# EAGLE design RMR-AVR-ISP-Shield (EAGLE 9.6.0)
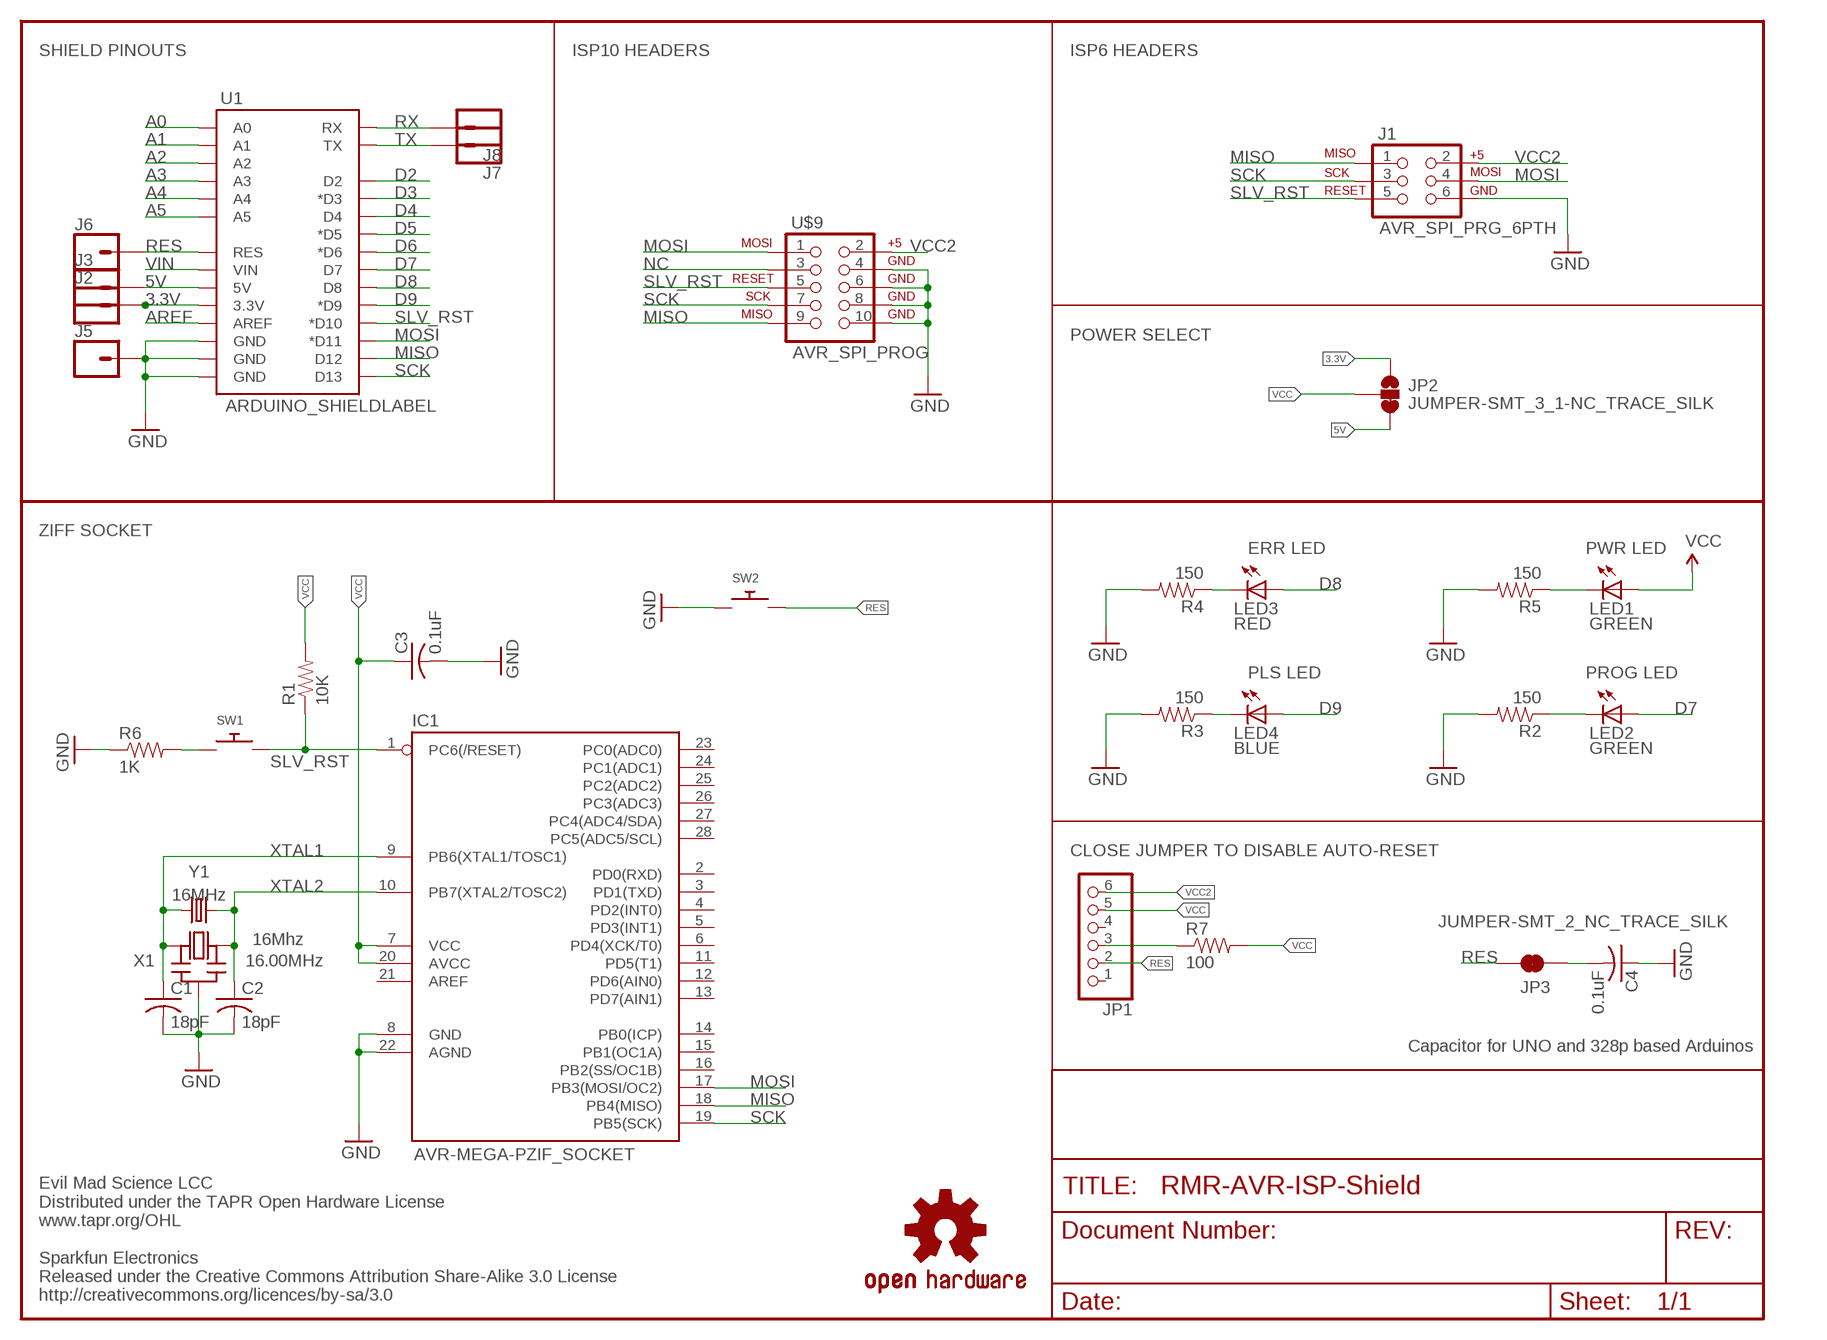
[diagram p0: schematic, sheet 1]

## Parts
C1  18pF  C-US025-024X044  [C025-024X044]
C2  18pF  C-US025-024X044  [C025-024X044]
C3  0.1uF  C-US025-024X044  [C025-024X044]
C4  0.1uF  C-US025-024X044  [C025-024X044]
IC1  AVR-MEGA-PZIF_SOCKET  AVR-MEGA8-PZIF_SOCKET  [DIL28-3-ZIF_SOCKET]
J1  AVR_SPI_PRG_6PTH  [2X3]
J2  CONN_01  [1X01]
J3  CONN_01  [1X01]
J5  CONN_01  [1X01]
J6  CONN_01  [1X01]
J7  CONN_01  [1X01]
J8  CONN_01  [1X01]
JP1  PINHD-1X6/90  [1X06/90]
JP2  JUMPER-SMT_3_1-NC_TRACE_SILK  [SMT-JUMPER_3_1-NC_TRACE_SILK]
JP3  JUMPER-SMT_2_NC_TRACE_SILK  [SMT-JUMPER_2_NC_TRACE_SILK]
LED1  GREEN  LED3MM  [LED3MM]
LED2  GREEN  LED3MM  [LED3MM]
LED3  RED  LED3MM  [LED3MM]
LED4  BLUE  LED3MM  [LED3MM]
R1  10K  RESISTORPTH-1/4W  [AXIAL-0.4]
R2  150  RESISTORPTH-1/4W  [AXIAL-0.4]
R3  150  RESISTORPTH-1/4W  [AXIAL-0.4]
R4  150  RESISTORPTH-1/4W  [AXIAL-0.4]
R5  150  RESISTORPTH-1/4W  [AXIAL-0.4]
R6  1K  RESISTORPTH-1/4W  [AXIAL-0.4]
R7  100  RESISTORPTH-1/4W  [AXIAL-0.4]
SW1  SWITCH_PUSHBUTTONEVQ-PE  [TACT_PANA-EVQ]
SW2  SWITCH_PUSHBUTTONEVQ-PE  [TACT_PANA-EVQ]
U1  ARDUINO_SHIELDLABEL  [DUEMILANOVE_SHIELD]
U$4  OSHW-LOGOM  [OSHW-LOGO-M]
U$9  AVR_SPI_PROG  [AVR_ICSP]
X1  16.00MHz  CERMOSCILL  [CERM_OSC]
Y1  16MHz  CRYSTAL-16MHZPTH-HC49US  [HC49US]

## Nets
3.3V: J2.1 JP2.1 U1.3.3V
5V: J3.1 JP2.3 U1.5V
A0: U1.A0
A1: U1.A1
A2: U1.A2
A3: U1.A3
A4: U1.A4
A5: U1.A5
AREF: U1.AREF
D2: U1.D2
D3: U1.D3(*D3)
D4: U1.D4
D5: U1.D5(*D5)
D6: U1.D6(*D6)
D7: LED2.A U1.D7
D8: LED3.A U1.D8
D9: LED4.A U1.D9(*D9)
GND: C1.2 C2.2 C3.2 C4.1 IC1.8(GND) IC1.22(AGND) J1.6 J5.1 R2.P$2 R3.P$2 R4.P$2 R5.P$2 R6.P$1 SW2.P$1 U1.GND@0(GND) U1.GND@1(GND) U1.GND@2(GND) U$9.4 U$9.6 U$9.8 U$9.10 X1.P$2(GND)
MISO: IC1.18(PB4(MISO)) J1.1 U1.D12 U$9.9
MOSI: IC1.17(PB3(MOSI/OC2)) J1.4 U1.D11(*D11) U$9.1
N$1: R6.P$2 SW1.P$1
N$2: LED2.K(C) R2.P$1
N$3: LED3.K(C) R4.P$1
N$4: LED1.K(C) R5.P$1
N$5: JP1.3 R7.P$1
N$6: LED4.K(C) R3.P$1
N$7: C4.2 JP3.1
NC: U$9.3
RES: J6.1 JP1.2 JP3.2 SW2.P$2 U1.RES
RX: J8.1 U1.RX
SCK: IC1.19(PB5(SCK)) J1.3 U1.D13 U$9.7
SLV_RST: IC1.1(PC6(/RESET)) J1.5 R1.P$1 SW1.P$2 U1.D10(*D10) U$9.5
TX: J7.1 U1.TX
VCC: C3.1 IC1.7(VCC) IC1.20(AVCC) JP1.5 JP2.2 LED1.A R1.P$2 R7.P$2
VCC2: J1.2 JP1.6 U$9.2
VIN: U1.VIN
XTAL1: C1.1 IC1.9(PB6(XTAL1/TOSC1)) X1.P$1(IN) Y1.1
XTAL2: C2.1 IC1.10(PB7(XTAL2/TOSC2)) X1.P$3(OUT) Y1.2
Unconnected: IC1.2(PD0(RXD)) IC1.3(PD1(TXD)) IC1.4(PD2(INT0)) IC1.5(PD3(INT1)) IC1.6(PD4(XCK/T0)) IC1.11(PD5(T1)) IC1.12(PD6(AIN0)) IC1.13(PD7(AIN1)) IC1.14(PB0(ICP)) IC1.15(PB1(OC1A)) IC1.16(PB2(SS/OC1B)) IC1.21(AREF) IC1.23(PC0(ADC0)) IC1.24(PC1(ADC1)) IC1.25(PC2(ADC2)) IC1.26(PC3(ADC3)) IC1.27(PC4(ADC4/SDA)) IC1.28(PC5(ADC5/SCL)) JP1.1 JP1.4

## Notes on the sheet
- SHIELD PINOUTS | ISP10 HEADERS | ISP6 HEADERS
- POWER SELECT
- ZIFF SOCKET
- ERR LED | PWR LED
- PLS LED | PROG LED
- CLOSE JUMPER TO DISABLE AUTO-RESET
- 16Mhz
- Capacitor for UNO and 328p based Arduinos
- Evil Mad Science LCC
  Distributed under the TAPR Open Hardware License
  www.tapr.org/OHL
  
  Sparkfun Electronics
  Released under the Creative Commons Attribution Share-Alike 3.0 License
  http://creativecommons.org/licences/by-sa/3.0

## Library data of the parts
C1-C4 = adafruit:C-US: CAPACITOR, American symbol
IC1 = SparkFun:AVR-MEGA8-P: MICROCONTROLLER 8 Kbytes FLASH 1 kbytes SRAM 512 bytes EEPROM USART 4-channel 10 bit ADC 2-channel 8 bit ADC
J1 = SparkFun:AVR_SPI_PRG_6: AVR ISP 6 Pin This is the reduced ISP connector for AVR programming. Common on Arduino. This footprint will take up less PCB space and can be used with a 10-pin to 6-pin adapter such as SKU: BOB-08508
J2 J3 J5-J8 = SparkFun-Connectors:CONN_01: Single connection point. Often used as Generic Header-pin footprint for 0.1 inch spaced/style header connections On any of the 0.1 inch spaced packages, you can populate with these: Break Away Headers - Straight <https://www.sparkfun.com/products/116> (PRT-00116) Break Away Male Headers - Right Angle <https://www.sparkfun.com/products/553> (PRT-00553) Female Headers <https://www.sparkfun.com/products/115> (PRT-00115) Break Away Headers - Machine Pin <https://www.sparkfun.com/products/117> (PRT-00117) Break Away Female Headers - Swiss Machine Pin <https://www.sparkfun.com/products/743> (PRT-00743) This device is also useful as a general connection point to wire up your design to another part of your project. Our various solder wires solder well into these plated through hole pads. Hook-Up Wire - Assortment (Stranded, 22 AWG) <https://www.sparkfun.com/products/11375> (PRT-11375) Hook-Up Wire - Assortment (Solid Core, 22 AWG) <https://www.sparkfun.com/products/11367> (PRT-11367) View the entire wire category on our website here <https://www.sparkfun.com/categories/141> Special notes: SMTSO-256-ET is a "flush mount" nut for a 4-40 screw. We mostly use this on specialty testbeds; it is a nice way to connect hardware to your PCB at an adjustable hieght. Also note, the SNAP packages are for using a snappable style connector. We sell a baggie of snaps and they are also used on two LilyPad designs: Snap Assortment - 30 pack (male and female) <https://www.sparkfun.com/products/11347> (DEV-11347) LilyPad Arduino SimpleSnap <https://www.sparkfun.com/products/10941> (DEV-10941) LilyPad SimpleSnap Protoboard <https://www.sparkfun.com/products/10940> (DEV-10940)
JP1 = pinhead:PINHD-1X6: PIN HEADER
JP2 = SparkFun-Jumpers:JUMPER-SMT_3_1-NC_TRACE: Normally closed trace jumper (1 of 2 connections) This jumper has a trace between two pads so it's normally closed (NC). The other connection is normally open (NO). Use a razor knife to open the connection. For best results follow the IPC guidelines for cutting traces: Cutout at least 0.063 mm (0.005 in). Remove all loose material to clean up the cut area. Seal the cut with an approved epoxy. Reapply solder to reclose the connection, or to close the NO connection.
JP3 = SparkFun-Jumpers:JUMPER-SMT_2_NC_TRACE: Normally closed trace jumper This jumper has a trace between two pads so it's normally closed (NC). Use a razor knife to open the connection. For best results follow the IPC guidelines for cutting traces: Cutout at least 0.063 mm (0.005 in). Remove all loose material to clean up the cut area. Seal the cut with an approved epoxy. Reapply solder to reclose the connection.
LED1-LED4 = SparkFun:LED: LEDs Standard schematic elements and footprints for 5mm, 3mm, 1206, and 0603 sized LEDs. 5mm - Spark Fun Electronics SKU : COM-00529 (and others)
R1-R7 = SparkFun:RESISTOR: Resistor Basic schematic elements and footprints for 0603, 1206, and PTH resistors.
SW1 SW2 = adafruit:SWITCH_PUSHBUTTON: Buttons SOFTTOUCHSMD_SJ - Soft touch temporary push button (Super Junk Akihabara) Compatible with SKPMANE010 [Mouser: 688-SKPMAN] C&K_KSS = Digikey: KSS221GLFS
U1 = SparkFun:ARDUINO_SHIELD
U$4 = SparkFun:OSHW-LOGO: Open Source Hardware Logo This logo indicates the piece of hardware it is found on incorporates a OSHW license and/or adheres to the definition of open source hardware found here: http://freedomdefined.org/OSHW
U$9 = SparkFun:AVR_SPI_PROG: AVR ICSP Header This is the standard AVR In Circuit Serial Programming header. Minimal, but includes pin one indicator. Works with standard Olimex programmers. Also look for the 6-pin reduced version. Spark Fun Electronics SKU: PRT-00778
X1 = digg:CERMOSCILL
Y1 = SparkFun-Clocks:CRYSTAL-16MHZ: 16MHz Crystal Digikey Example <http://www.digikey.com/product-search/en?keywords=535-9122-1-ND> Frequency: 16MHz Frequency Stability: ±50ppm Frequency Tolerance: ±20ppm Load Capacitance: 18pF SparkFun Products: Pro Micro -5V/16MHz <https://www.sparkfun.com/products/12640> SparkFun Serial Enabled LCD Kit <https://www.sparkfun.com/products/10097>; PROD_ID: XTAL-08181; SF_ID: COM-00536

## Net classes
1 vcc: width 0.254 mm

## Board
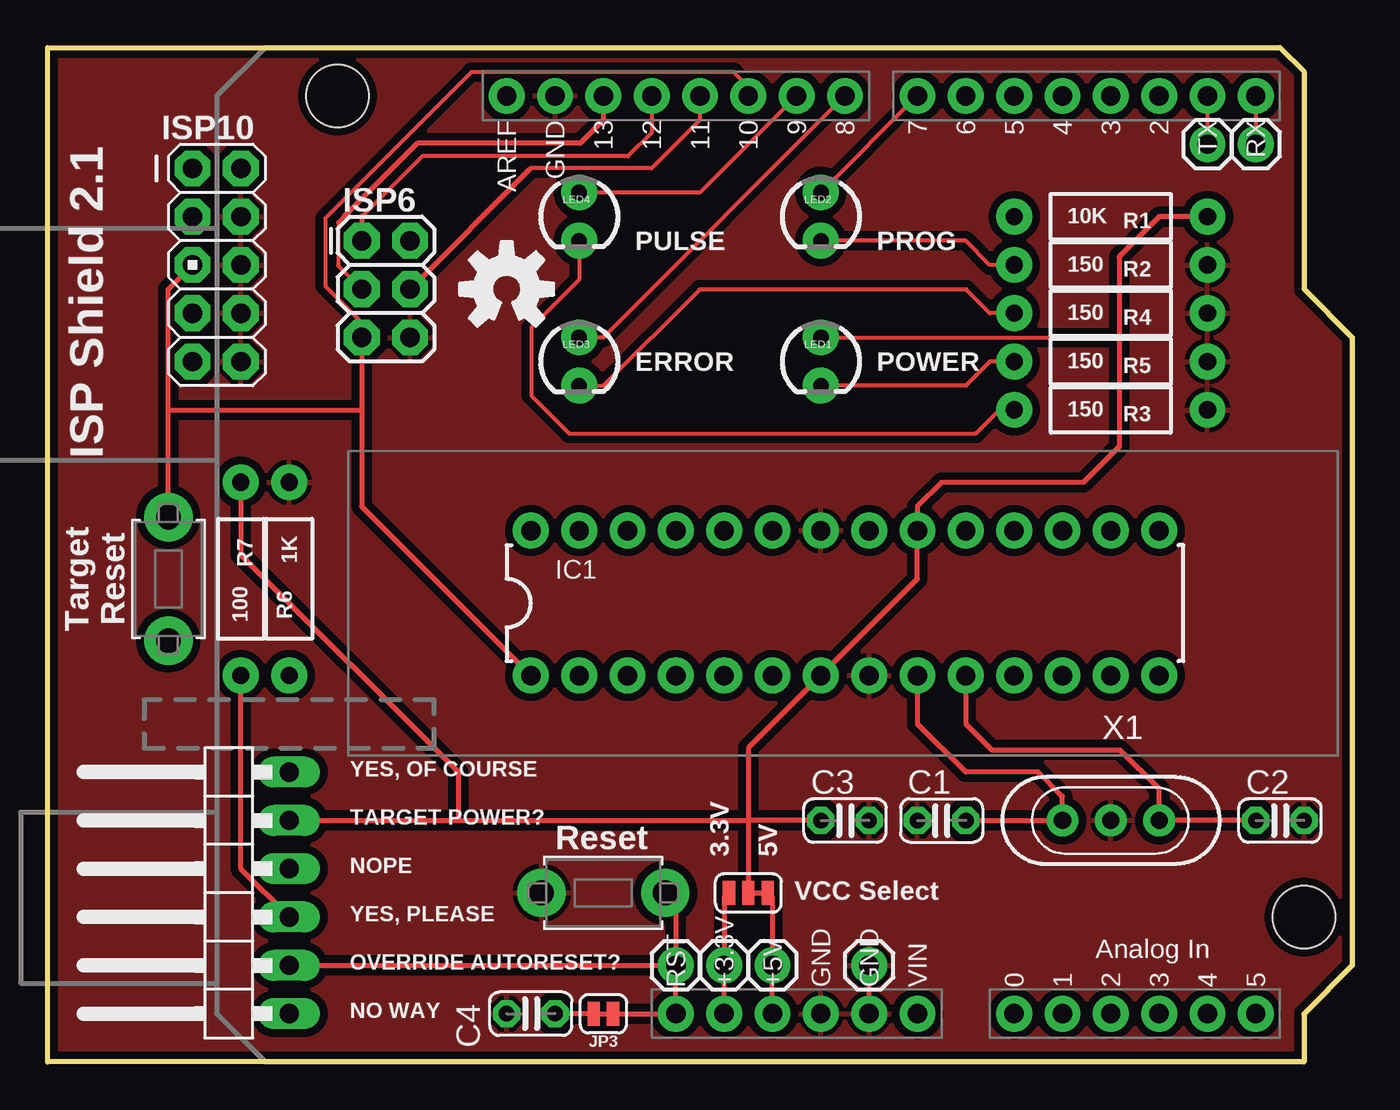
[diagram p1: board, top side]
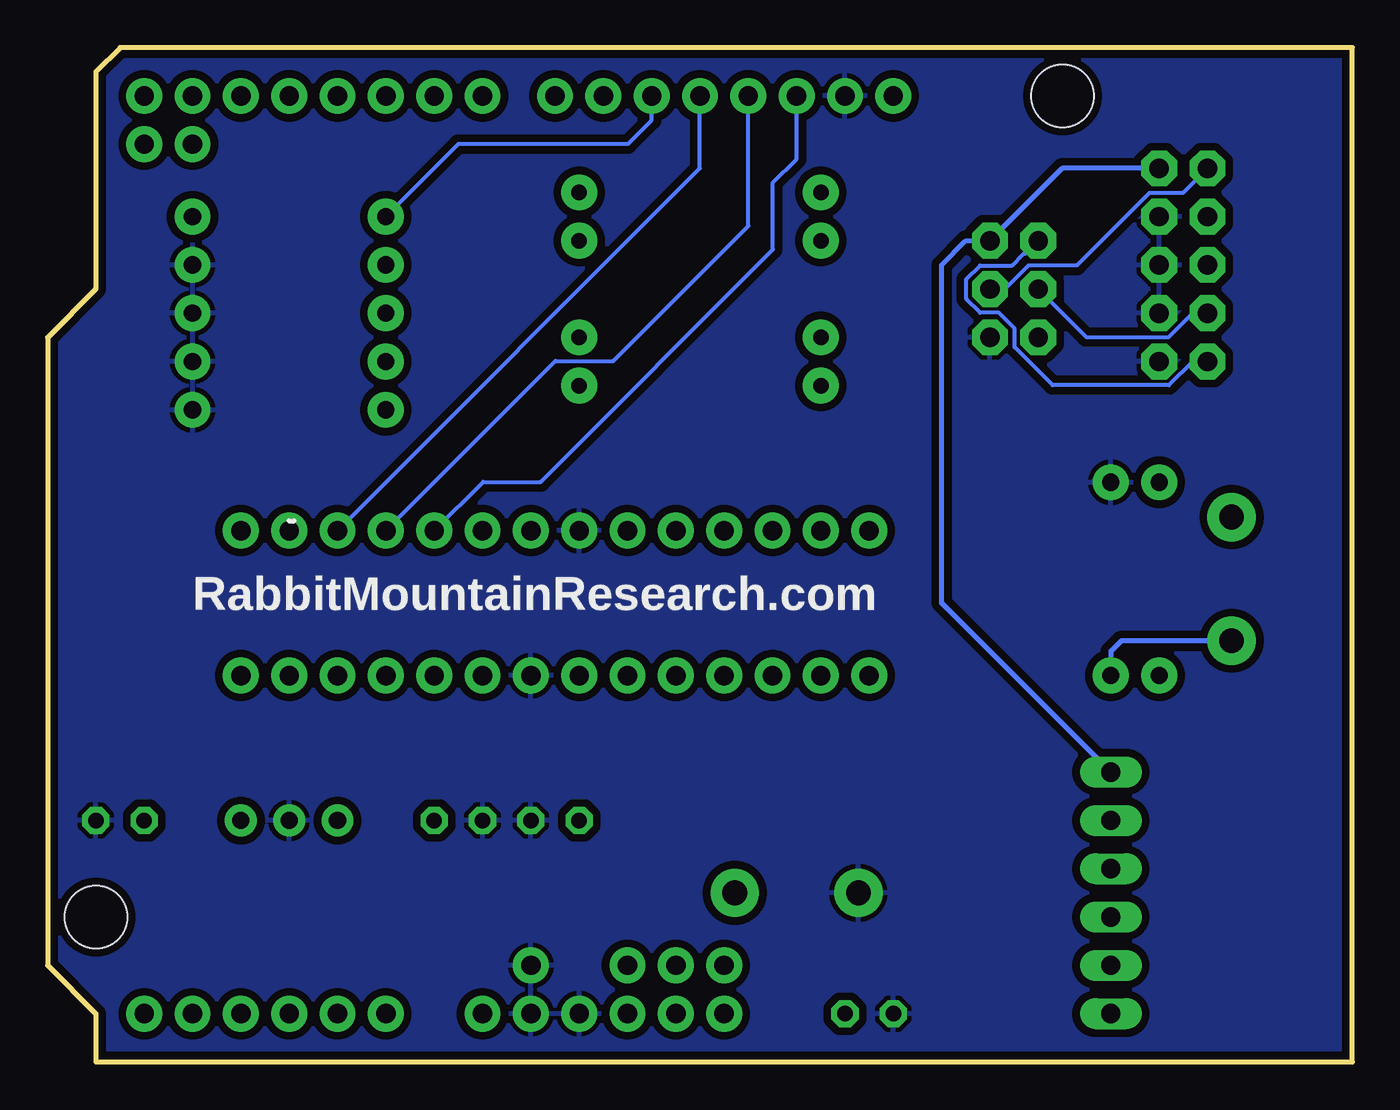
[diagram p2: board, bottom side, seen from below]

Size 68.58 x 53.34 mm. Coordinates in mm from the lower left corner, seen from the top.
Outline: 0,53.34 64.77,53.34 66.04,52.07 66.04,40.64 68.58,38.1 68.58,5.08 66.04,2.54 66.04,0 0,0 0,53.34
Copper layers (1*16): Top 0.035mm / dielectric 1.5mm / Bottom 0.035mm
Design rules "default *": minimum track width 8mil, minimum drill 20mil, track to track 16mil, track to pad 8mil, pad to pad 8mil, via to via 8mil, smd to smd 8mil, copper to edge 16mil, drill to drill 8mil, minimum pad ring 12mil, minimum via ring 10mil, stop-mask expansion 4mil, vias tented up to drill 20mil, thermal gap 10mil

### Footprints (pad centres in the part's own frame; a part is rotated, then mirrored left to right if it is on the bottom)
C025-024X044 = drill 0.813 pad 1.422 octagon: 1 -1.27,0; 2 1.27,0
DIL28-3-ZIF_SOCKET = drill 1.016 pad 1.88: 1 -16.51,-3.81; 2 -13.97,-3.81; 3 -11.43,-3.81; 4 -8.89,-3.81; 5 -6.35,-3.81; 6 -3.81,-3.81; 7 -1.27,-3.81; 8 1.27,-3.81; 9 3.81,-3.81; 10 6.35,-3.81; 11 8.89,-3.81; 12 11.43,-3.81; 13 13.97,-3.81; 14 16.51,-3.81; 15 16.51,3.81; 16 13.97,3.81; 17 11.43,3.81; 18 8.89,3.81; 19 6.35,3.81; 20 3.81,3.81; 21 1.27,3.81; 22 -1.27,3.81; 23 -3.81,3.81; 24 -6.35,3.81; 25 -8.89,3.81; 26 -11.43,3.81; 27 -13.97,3.81; 28 -16.51,3.81
2X3 = drill 1.016 pad 1.88 octagon: 1 0,0; 2 0,2.54; 3 2.54,0; 4 2.54,2.54; 5 5.08,0; 6 5.08,2.54
1X01 = drill 1.016 pad 1.88: 1 0,0
1X06/90 = drill 1.016 long: 1 -6.35,-3.81; 2 -3.81,-3.81; 3 -1.27,-3.81; 4 1.27,-3.81; 5 3.81,-3.81; 6 6.35,-3.81
SMT-JUMPER_3_1-NC_TRACE_SILK = smd 0.635 x 1.27: 1 -1.016,0; 2 0,0; 3 1.016,0
SMT-JUMPER_2_NC_TRACE_SILK = smd 0.635 x 1.27: 1 -0.508,0; 2 0.508,0
LED3MM = drill 0.813 pad 1.88: A -1.27,0; K 1.27,0
AXIAL-0.4 = drill 0.9 pad 1.88: P$1 -5.08,0; P$2 5.08,0
TACT_PANA-EVQ = drill 1.3 pad 2.54: P$1 -3.25,0; P$2 3.25,0
DUEMILANOVE_SHIELD = drill 1.016 pad 1.88: 3.3V 50.8,26.67; 5V 50.8,29.21; A0 50.8,41.91; A1 50.8,44.45; A2 50.8,46.99; A3 50.8,49.53; A4 50.8,52.07; A5 50.8,54.61; AREF 2.54,15.24; D2 2.54,49.53; D3 2.54,46.99; D4 2.54,44.45; D5 2.54,41.91; D6 2.54,39.37; D7 2.54,36.83; D8 2.54,33.02; D9 2.54,30.48; D10 2.54,27.94; D11 2.54,25.4; D12 2.54,22.86; D13 2.54,20.32; GND@0 50.8,31.75; GND@1 50.8,34.29; GND@2 2.54,17.78; RES 50.8,24.13; RX 2.54,54.61; TX 2.54,52.07; VIN 50.8,36.83 | hole 3.302: 45.72,57.15; 2.54,6.35
AVR_ICSP = drill 1.016 pad 1.88 octagon: 1 -1.27,5.08; 2 1.27,5.08; 3 -1.27,2.54; 4 1.27,2.54; 5 -1.27,0; 6 1.27,0; 7 -1.27,-2.54; 8 1.27,-2.54; 9 -1.27,-5.08; 10 1.27,-5.08
CERM_OSC = drill 0.9 pad 1.676: P$1 -2.54,0; P$2 0,0; P$3 2.54,0
HC49US = drill 0.7 pad 1.651: 1 -2.54,0; 2 2.54,0

### Placement (x,y rotation side)
C1  46.99,12.7 180 top
C2  64.77,12.7 0 top
C3  41.91,12.7 0 top
C4  25.4,2.54 0 top
IC1  41.91,24.13 0 top
J1  16.51,43.18 270 top
J2  35.56,5.08 0 top
J3  38.1,5.08 0 top
J5  43.18,5.08 0 top
J6  33.02,5.08 0 top
J7  60.96,48.26 0 top
J8  63.5,48.26 0 top
JP1  8.89,8.89 90 top
JP2  36.83,8.89 0 top
JP3  29.21,2.54 0 top
LED1  40.64,36.83 270 top
LED2  40.64,44.45 270 top
LED3  27.94,36.83 270 top
LED4  27.94,44.45 270 top
R1  55.88,44.45 0 top
R2  55.88,41.91 0 top
R3  55.88,34.29 0 top
R4  55.88,39.37 0 top
R5  55.88,36.83 0 top
R6  12.7,25.4 270 top
R7  10.16,25.4 90 top
SW1  6.35,25.4 90 top
SW2  29.21,8.89 0 top
U1  8.89,53.34 270 top
U$4  24.13,40.64 0 top
U$9  8.89,41.91 0 top
X1  55.88,12.7 0 top
Y1  55.88,12.7 0 top

### Tracks (layer width: path | path; a pad name or v marks a point on that pad's centre or on a via)
3.3V
  Top 0.254: U1.3.3V J2.1 35.56,8.64 JP2.1
5V
  Top 0.254: U1.5V J3.1 38.1,8.64 JP2.3
D7
  Top 0.203: U1.D7 LED2.A
D8
  Top 0.203: U1.D8 29.21,38.1 LED3.A
D9
  Top 0.203: U1.D9 34.29,45.72 LED4.A
GND
  Top 0.254: U1.GND@1 J5.1
  pour Top: 64.77,53.34 66.04,52.07 66.04,40.64 68.58,38.1 68.58,5.08 66.04,2.54 66.04,0 0,0 0,53.34
  pour Bottom: 69.85,54.61 69.85,-1.27 -1.27,-1.27 -1.27,54.61
MISO
  Top 0.203: U1.D12 31.75,48.87 30.5,47.62 19.69,47.62 16.51,44.45
  Top 0.254: 16.51,44.45 J1.1
  Bottom 0.203: J1.1 17.2,42.49 17.28,42.49 17.89,41.88 19.57,41.88 20.3,41.16 20.3,40.12 19.57,39.4 18.59,39.4 17.76,38.56 17.76,37.58 15.76,35.59 9.64,35.59 8.4,36.83 U$9.9 | IC1.18 41.88,36.85 38.85,36.85 31.75,43.96 U1.D12
MOSI
  Top 0.203: U1.D11 34.29,49.53 31.75,46.99 25.4,46.99
  Top 0.254: J1.4 25.4,46.99
  Bottom 0.203: U$9.1 8.92,45.7 10.68,45.7 14.49,41.88 17.03,41.88 18.27,40.64 J1.4 | IC1.17 34.29,46.99 U1.D11
N$1
  Bottom 0.254: SW1.P$1 12.14,22.15 12.7,21.59 R6.P$2
N$2
  Top 0.203: R2.P$1 49.53,41.91 48.26,43.18 LED2.K
N$3
  Top 0.203: R4.P$1 49.53,39.37 48.29,40.62 34.27,40.62 29.21,35.56 LED3.K
N$4
  Top 0.203: R5.P$1 49.53,36.83 48.26,35.56 LED1.K
N$5
  Top 0.254: JP1.3 10.16,10.16 R7.P$1
N$6
  Top 0.203: R3.P$1 50.02,34.29 48.78,33.05 27.42,33.05 25.43,35.04 25.43,38.62 27.94,41.13 LED4.K
N$7
  Top 0.254: JP3.1 C4.2
RES
  Top 0.254: J6.1 U1.RES JP3.2 | JP1.2 J6.1 | SW2.P$2 33.02,8.33 J6.1
RX
  Top 0.203: U1.RX J8.1
SCK
  Top 0.203: 15.58,44.45 15.27,44.14 15.27,41.88 J1.3
  Top 0.254: U1.D13 29.21,49.53 27.99,48.31 19.44,48.31 15.58,44.45
  Bottom 0.203: U$9.7 8.4,39.37 9.64,38.12 14,38.12 J1.3 | IC1.19 45.7,30.5 42.66,30.5 30.46,42.72 30.46,46.24 29.21,47.48 U1.D13
SLV_RST
  Top 0.203: U1.D10 36.83,51.29 36.08,52.05 22.27,52.05 14.61,44.38 14.61,40.78 16.51,38.88 J1.5
  Top 0.254: SW1.P$2 6.35,34.29 | 6.35,34.29 6.35,40.64 U$9.5 | J1.5 16.51,34.29 | 16.51,34.29 16.51,29.21 IC1.1 | 6.35,34.29 16.51,34.29
  Bottom 0.203: U1.D10 36.83,49.53 38.1,48.26 46.99,48.26 R1.P$1
TX
  Top 0.203: U1.TX J7.1
VCC
  Top 0.203: LED1.A 56.31,38.1
  Top 0.254: 36.83,12.7 36.83,16.51 IC1.7 45.72,25.4 IC1.20 45.72,29.21 46.99,30.48 54.44,30.48 56.31,32.35 56.31,38.1 56.31,42.34 58.42,44.45 R1.P$2 | 36.83,12.7 JP2.2 | C3.1 36.83,12.7 | JP1.5 21.59,12.7 | 21.59,12.7 36.83,12.7 | R7.P$2 10.16,26.67 21.59,15.24 21.59,12.7
VCC2
  Bottom 0.254: JP1.6 21.59,24.13 21.59,41.91 20.32,43.18 J1.2 15.24,46.99 U$9.2
XTAL1
  Top 0.254: IC1.9 45.72,17.78 48.26,15.24 52.07,15.24 53.34,13.97 Y1.1 C1.1
XTAL2
  Top 0.254: C2.1 Y1.2 58.42,14.35 56.36,16.41 49.63,16.41 48.26,17.78 IC1.10

### Text on the board
tPlace: ISP10 | ISP6 | PULSE | PROG | ERROR | POWER | ISP Shield 2.1 | Target / Reset | YES, OF COURSE | TARGET POWER? | Reset | 3.3V | 5V | NOPE | VCC Select | YES, PLEASE | OVERRIDE AUTORESET? | NO WAY
bPlace: RabbitMountainResearch.com
tValues: Evil Mad Science LCC / Distributed under the TAPR Open Hardware License / www.tapr.org/OHL / / Sparkfun Electronics / Released under the Creative Commons Attribution Share-Alike 3.0 License / http://creativecommons.org/licences/by-sa/3.0 / / Clone / Mashup by Andrew Barney / Rabbit Mountain Research